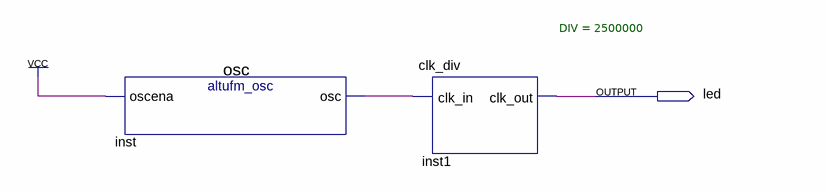
[diagram p0: schematic sheet]
// Quartus schematic int_osc.bdf as structural Verilog: 2 symbols, 1 pins
module int_osc (
  output led
);

  wire inst_osc;

  osc inst (.oscena(1'b1), .osc(inst_osc));
  clk_div #(.DIV(2500000)) inst1 (.clk_in(inst_osc), .clk_out(led));
endmodule
